# Altium schematic sheet Sheet1.SchDoc
size A4; SheetNumber: 1; SheetTotal: 1
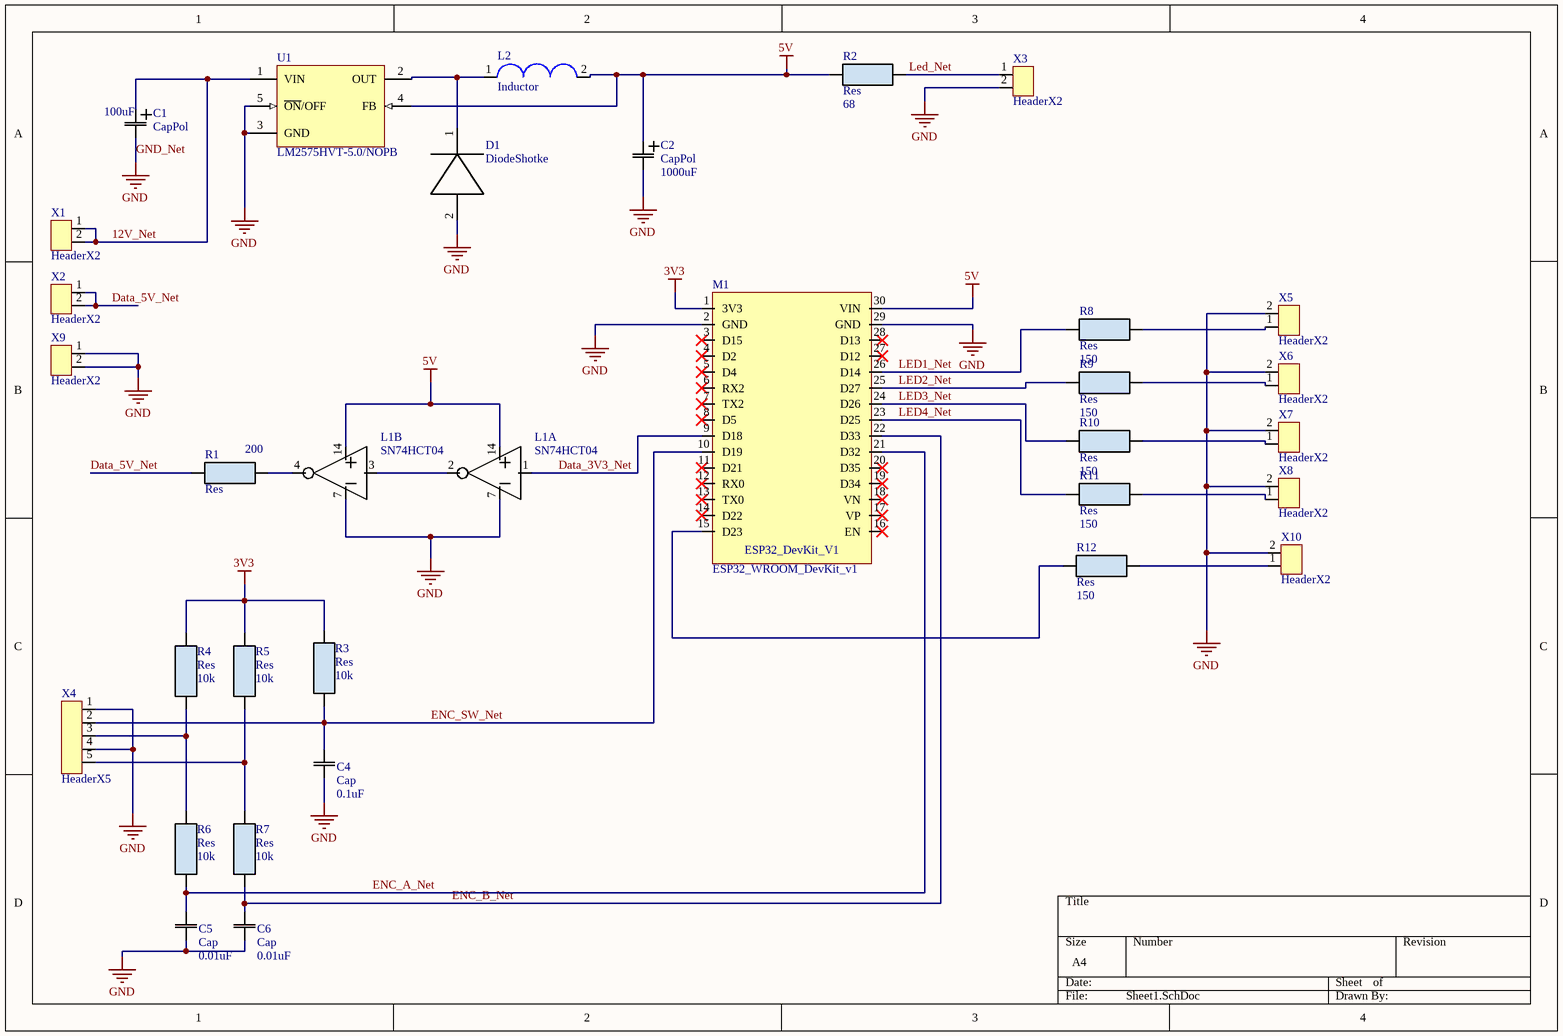
[diagram p0: Sheet1.SchDoc]

## Parts
C1  CapPol  value 100uF  [CAP 8x7]
C2  CapPol  value 1000uF  [CAP 10x12.5]
C4  Cap  value 0.1uF  [Cap K73-17 0.1uF 100V 5-10%]
C5  Cap  value 0.01uF  [Cap K73-17 0.01uF 100V 5-10%]
C6  Cap  value 0.01uF  [Cap K73-17 0.01uF 100V 5-10%]
D1  DiodeShotke  [DIODE_SHOTKE]
L1  SN74HCT04  [DIP-14]  (parts A,B of 6)
L2  Inductor  [RLB0912-101KL]
M1  ESP32_WROOM_DevKit_v1  [ESP32_WROOM_DevKit_v1]
R1  Res  value 200  [Resistor MF-25]
R2  Res  value 68  [Resistor MF-25]
R3  Res  value 10k  [Resistor MF-25]
R4  Res  value 10k  [Resistor MF-25]
R5  Res  value 10k  [Resistor MF-25]
R6  Res  value 10k  [Resistor MF-25]
R7  Res  value 10k  [Resistor MF-25]
R8  Res  value 150  [Resistor MF-25]
R9  Res  value 150  [Resistor MF-25]
R10  Res  value 150  [Resistor MF-25]
R11  Res  value 150  [Resistor MF-25]
R12  Res  value 150  [Resistor MF-25]
U1  LM2575HVT-5.0/NOPB  [KC0005A]
X1  HeaderX2  [TERMINAL_X2_5MM]
X2  HeaderX2  [TERMINAL_X2_5MM]
X3  HeaderX2  [HEADERX2]
X4  HeaderX5  [HeaderX5]
X5  HeaderX2  [HEADERX2]
X6  HeaderX2  [HEADERX2]
X7  HeaderX2  [HEADERX2]
X8  HeaderX2  [HEADERX2]
X9  HeaderX2  [TERMINAL_X2_5MM]
X10  HeaderX2  [HEADERX2]

## Nets
3V3: M1.1(3V3) R3.2 R4.2 R5.2
5V: C2.1 L1.14 L2.2 M1.30(VIN) R2.1 U1.4(FB)
GND_Net: C1.2 C2.2 C4.1 C5.1 C6.1 D1.2 L1.7 M1.2(GND) M1.29(GND) U1.3(GND) U1.5(~{ON}/OFF) X3.2 X4.1(BTN_GND) X4.4 X5.2 X6.2 X7.2 X8.2 X9.1 X9.2 X10.2  [also labelled GND]
12V_Net: C1.1 U1.1(VIN) X1.1 X1.2
Data_3V3_Net: L1.1(A) M1.9(D18)
Data_5V_Net: R1.1 X2.1 X2.2
ENC_A_Net: C5.2 M1.21(D32) R6.1
ENC_B_Net: C6.2 M1.22(D33) R7.1
ENC_SW_Net: C4.2 M1.10(D19) R3.1 X4.2
LED1_Net: M1.26(D14) R8.1
LED2_Net: M1.25(D27) R9.1
LED3_Net: M1.24(D26) R10.1
LED4_Net: M1.23(D25) R11.1
Led_Net: R2.2 X3.1
NetD1_1: D1.1 L2.1 U1.2(OUT)
NetL1_2: L1.2(Y) L1.3(A)
NetL1_4: L1.4(Y) R1.2
NetM1_15: M1.15(D23) R12.1
NetR4_1: R4.1 R6.2 X4.3
NetR5_1: R5.1 R7.2 X4.5
NetR8_2: R8.2 X5.1
NetR9_2: R9.2 X6.1
NetR10_2: R10.2 X7.1
NetR11_2: R11.2 X8.1
NetR12_2: R12.2 X10.1

Not connected (* = marked no-connect by the designer): M1 3(D15)* 4(D2)* 5(D4)* 6(RX2)* 7(TX2)* 8(D5)* 11(D21)* 12(RX0)* 13(TX0)* 14(D22)* 16(EN)* 17(VP)* 18(VN)* 19(D34)* 20(D35)* 27(D12)* 28(D13)*

## Notes on the sheet
- (in symbol ESP32_WROOM_DevKit_v1) ESP32_DevKit_V1

## Library data of the parts
U1 = CMP-0069-02007-3: SIMPLE SWITCHER® 1A Step-Down Voltage Regulator, 5-pin TO-220, Pb-Free; Manufacturer: Texas Instruments; PowerWise: N; PackageTopMarking: NSUZXYTTE#*LM2575HVT*-5.0 P+; Code_JEDEC: TO-220-AB; CompType: Switcher; PinCount: 5; ComponentLink1URL: http://www.ti.com/general/docs/lit/getliterature.tsp?genericPartNumber=LM2575HV&fileType=pdf; RoHS: Y; PackageDescription: TO-220, Molded, 5 Lead, Straight; ComponentLink1Description: Datasheet URL; PackageReference: KC0005A